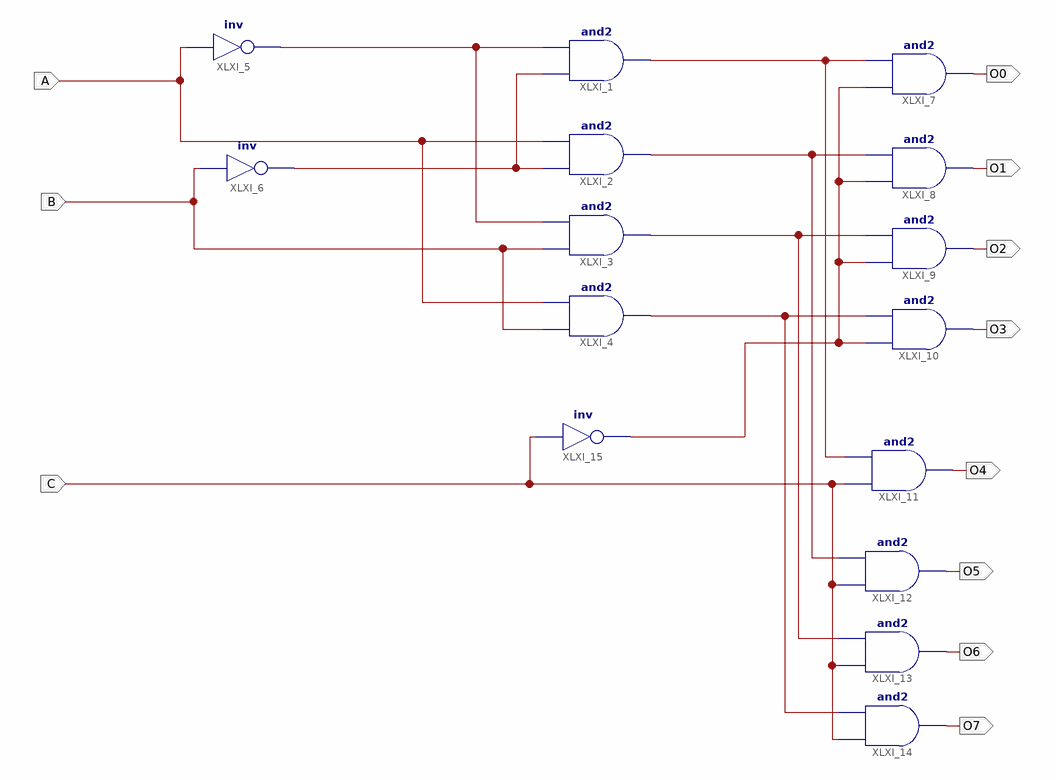
[diagram p0: schematic sheet 1]
// Xilinx ISE schematic Decoder_38_sch.sch (kintex7) as structural Verilog: 15 symbols, 11 ports
module Decoder_38_sch (
  input  A,
  input  B,
  input  C,
  output O0,
  output O1,
  output O2,
  output O3,
  output O4,
  output O5,
  output O6,
  output O7
);

  wire XLXN_11, XLXN_15, XLXN_19, XLXN_21, XLXN_23, XLXN_28, XLXN_32;

  and XLXI_1 (XLXN_19, XLXN_15, XLXN_11);
  and XLXI_2 (XLXN_21, XLXN_15, A);
  and XLXI_3 (XLXN_23, B, XLXN_11);
  and XLXI_4 (XLXN_28, B, A);
  not XLXI_5 (XLXN_11, A);
  not XLXI_6 (XLXN_15, B);
  and XLXI_7 (O0, XLXN_32, XLXN_19);
  and XLXI_8 (O1, XLXN_32, XLXN_21);
  and XLXI_9 (O2, XLXN_32, XLXN_23);
  and XLXI_10 (O3, XLXN_32, XLXN_28);
  and XLXI_11 (O4, C, XLXN_19);
  and XLXI_12 (O5, C, XLXN_21);
  and XLXI_13 (O6, C, XLXN_23);
  and XLXI_14 (O7, C, XLXN_28);
  not XLXI_15 (XLXN_32, C);
endmodule
